# EAGLE schematic SOL_AMPV2 (EAGLE 7.4.0)

## Sheet 1 of 4
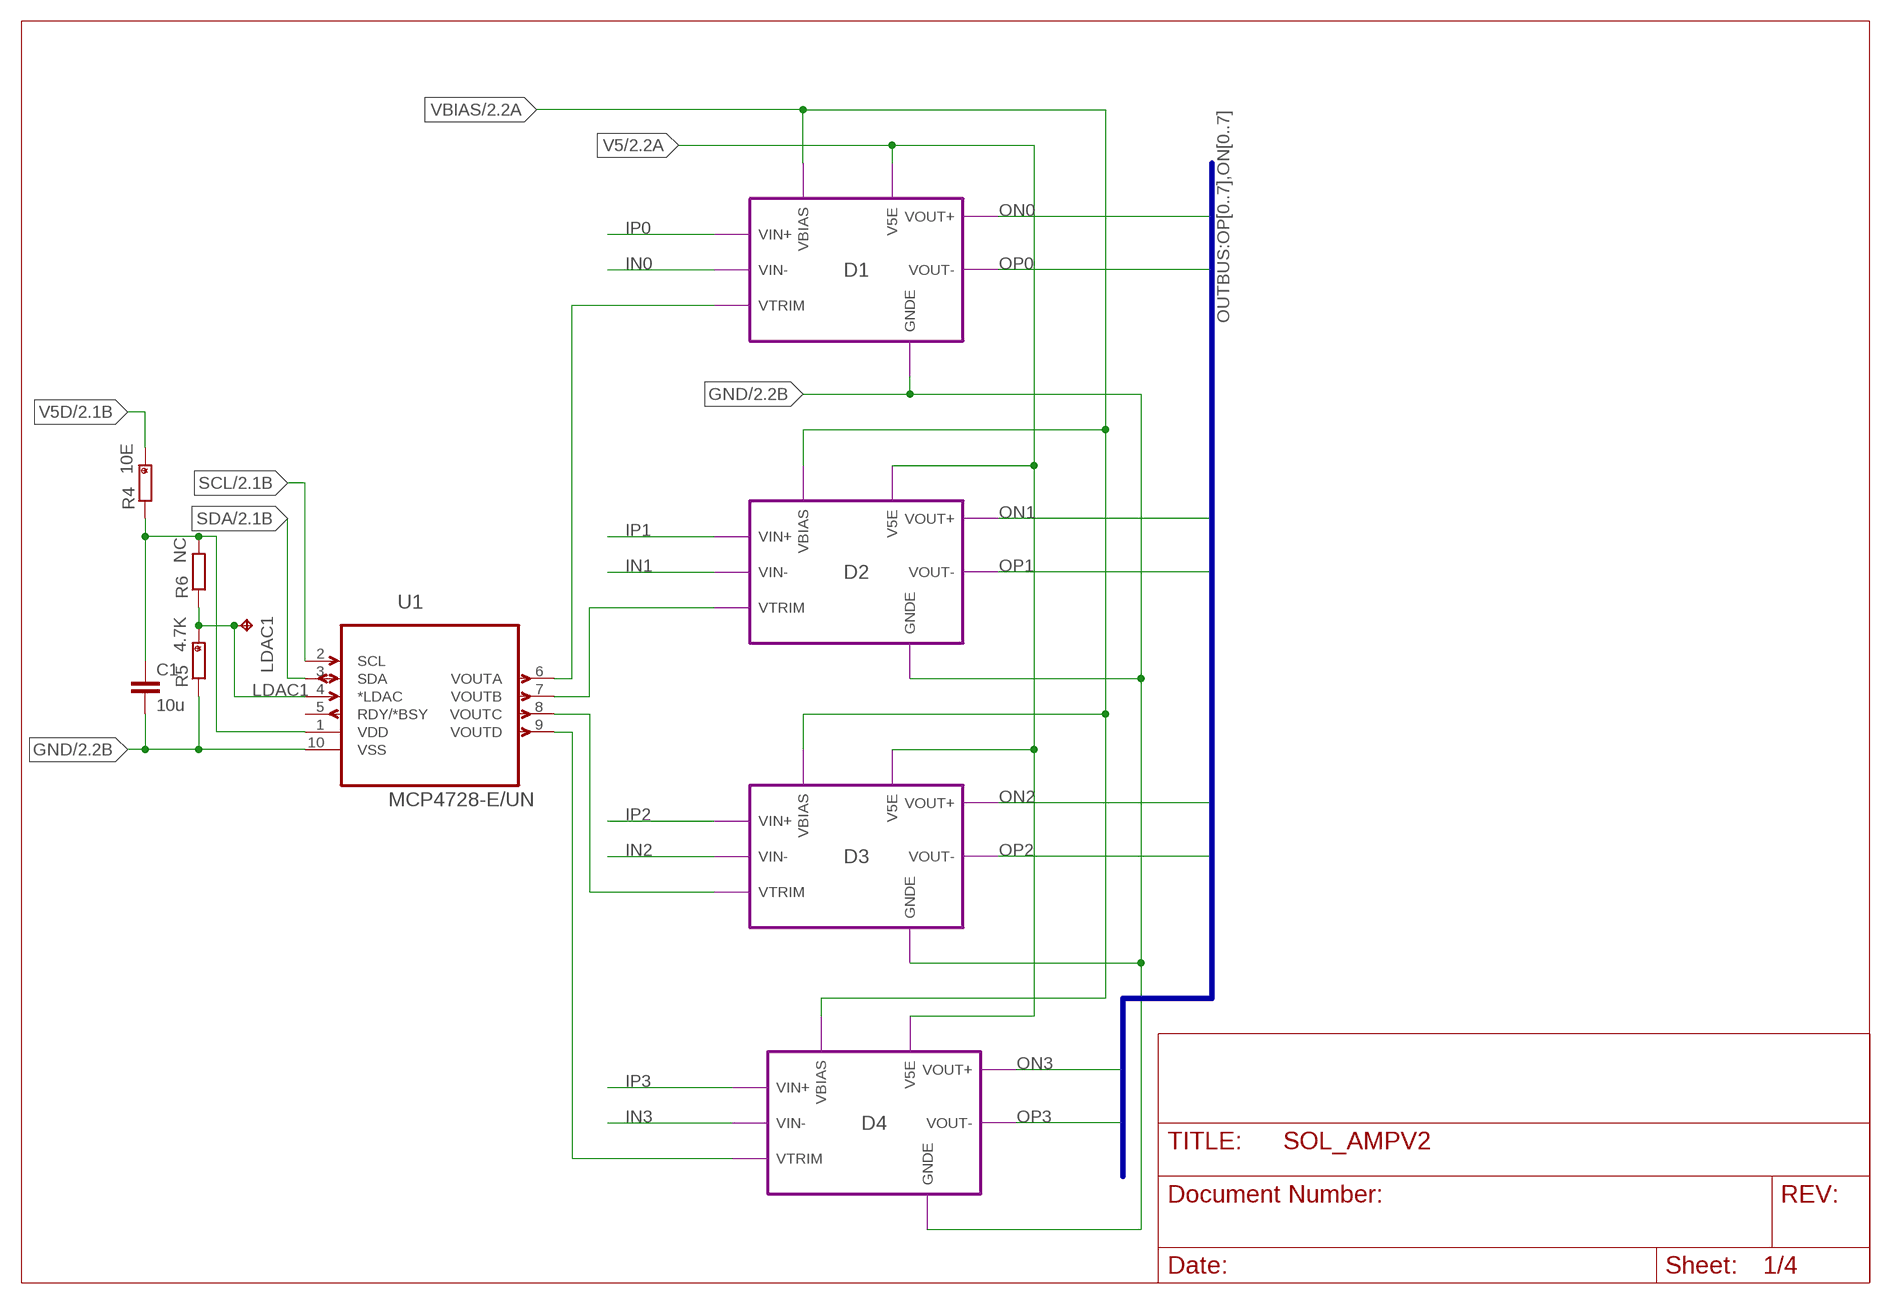
[diagram p0: schematic, sheet 1]

### Parts
C1  10u  C-EUC0805  [C0805]
LDAC1  UA_TPPAD1-13  [UA_P1-13]
R4  10E  R_HAND  [R0805H]
R5  4.7K  R_HAND  [R0805H]
R6  NC  R-EU_R0402  [R0402]
U1  MCP4728-E/UN  [SOP50P490X110-10N]

### Module instances
D2 = DIFFAMP
D1 = DIFFAMP
D3 = DIFFAMP
D4 = DIFFAMP

### Nets
GND: C1.2 R5.1 U1.10(VSS) ; port D2.GNDE D3.GNDE D4.GNDE D1.GNDE ; also sheet 2,3,4
IN0: port D1.VIN- ; also sheet 3
IN1: port D2.VIN- ; also sheet 3
IN2: port D3.VIN- ; also sheet 3
IN3: port D4.VIN- ; also sheet 3
IP0: port D1.VIN+ ; also sheet 3
IP1: port D2.VIN+ ; also sheet 3
IP2: port D3.VIN+ ; also sheet 3
IP3: port D4.VIN+ ; also sheet 3
LDAC1: LDAC1.TP R5.2 R6.1 U1.4(*LDAC)
N$1: C1.1 R4.1 R6.2 U1.1(VDD)
ON0: port D1.VOUT+ ; also sheet 3
ON1: port D2.VOUT+ ; also sheet 3
ON2: port D3.VOUT+ ; also sheet 3
ON3: port D4.VOUT+ ; also sheet 3
OP0: port D1.VOUT- ; also sheet 3
OP1: port D2.VOUT- ; also sheet 3
OP2: port D3.VOUT- ; also sheet 3
OP3: port D4.VOUT- ; also sheet 3
SCL: U1.2(SCL) ; also sheet 2,4
SDA: U1.3(SDA) ; also sheet 2,4
V5: port D2.V5E D3.V5E D4.V5E D1.V5E ; also sheet 2,4
V5D: R4.2 ; also sheet 2,4
VBIAS: port D2.VBIAS D3.VBIAS D4.VBIAS D1.VBIAS ; also sheet 2,4
VTR1: U1.6(VOUTA) ; port D1.VTRIM
VTR2: U1.7(VOUTB) ; port D2.VTRIM
VTR3: U1.8(VOUTC) ; port D3.VTRIM
VTR4: U1.9(VOUTD) ; port D4.VTRIM
Unconnected: U1.5(RDY/*BSY)

### Buses
OUTBUS:OP[0..7],ON[0..7]

## Sheet 2 of 4
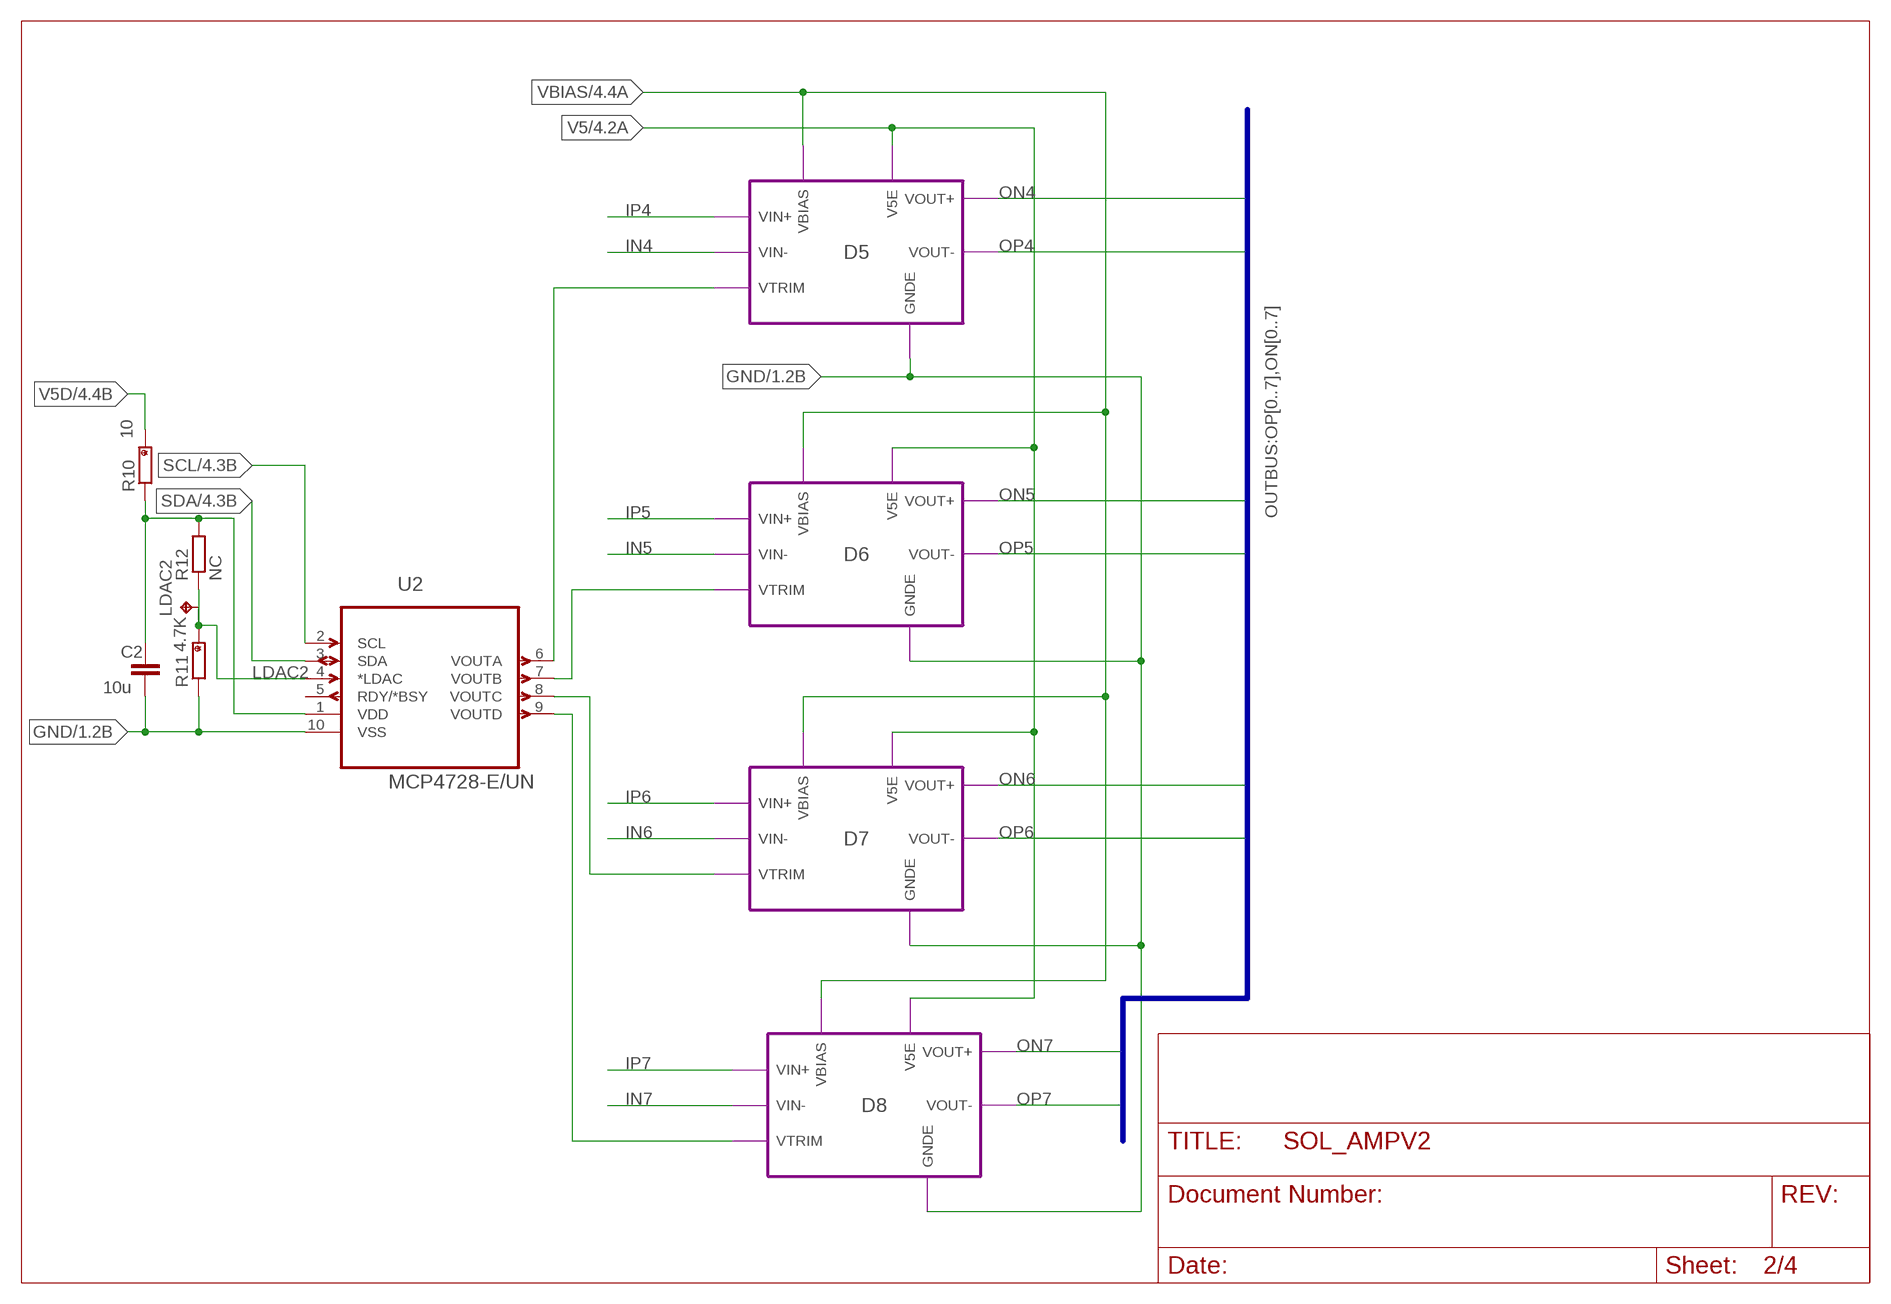
[diagram p1: schematic, sheet 2]

### Parts
C2  10u  C-EUC0805  [C0805]
LDAC2  UA_TPPAD1-13  [UA_P1-13]
R10  10  R_HAND  [R0805H]
R11  4.7K  R_HAND  [R0805H]
R12  NC  R-EU_R0402  [R0402]
U2  MCP4728-E/UN  [SOP50P490X110-10N]

### Module instances
D5 = DIFFAMP
D6 = DIFFAMP
D7 = DIFFAMP
D8 = DIFFAMP

### Nets
GND: C2.2 R11.1 U2.10(VSS) ; port D6.GNDE D7.GNDE D8.GNDE D5.GNDE ; also sheet 1,3,4
IN4: port D5.VIN- ; also sheet 3
IN5: port D6.VIN- ; also sheet 3
IN6: port D7.VIN- ; also sheet 3
IN7: port D8.VIN- ; also sheet 3
IP4: port D5.VIN+ ; also sheet 3
IP5: port D6.VIN+ ; also sheet 3
IP6: port D7.VIN+ ; also sheet 3
IP7: port D8.VIN+ ; also sheet 3
LDAC2: LDAC2.TP R11.2 R12.1 U2.4(*LDAC)
N$11: C2.1 R10.1 R12.2 U2.1(VDD)
ON4: port D5.VOUT+ ; also sheet 3
ON5: port D6.VOUT+ ; also sheet 3
ON6: port D7.VOUT+ ; also sheet 3
ON7: port D8.VOUT+ ; also sheet 3
OP4: port D5.VOUT- ; also sheet 3
OP5: port D6.VOUT- ; also sheet 3
OP6: port D7.VOUT- ; also sheet 3
OP7: port D8.VOUT- ; also sheet 3
SCL: U2.2(SCL) ; also sheet 1,4
SDA: U2.3(SDA) ; also sheet 1,4
V5: port D5.V5E D6.V5E D7.V5E D8.V5E ; also sheet 1,4
V5D: R10.2 ; also sheet 1,4
VBIAS: port D6.VBIAS D7.VBIAS D8.VBIAS D5.VBIAS ; also sheet 1,4
VTR5: U2.6(VOUTA) ; port D5.VTRIM
VTR6: U2.7(VOUTB) ; port D6.VTRIM
VTR7: U2.8(VOUTC) ; port D7.VTRIM
VTR8: U2.9(VOUTD) ; port D8.VTRIM
Unconnected: U2.5(RDY/*BSY)

### Buses
OUTBUS:OP[0..7],ON[0..7]

## Sheet 3 of 4
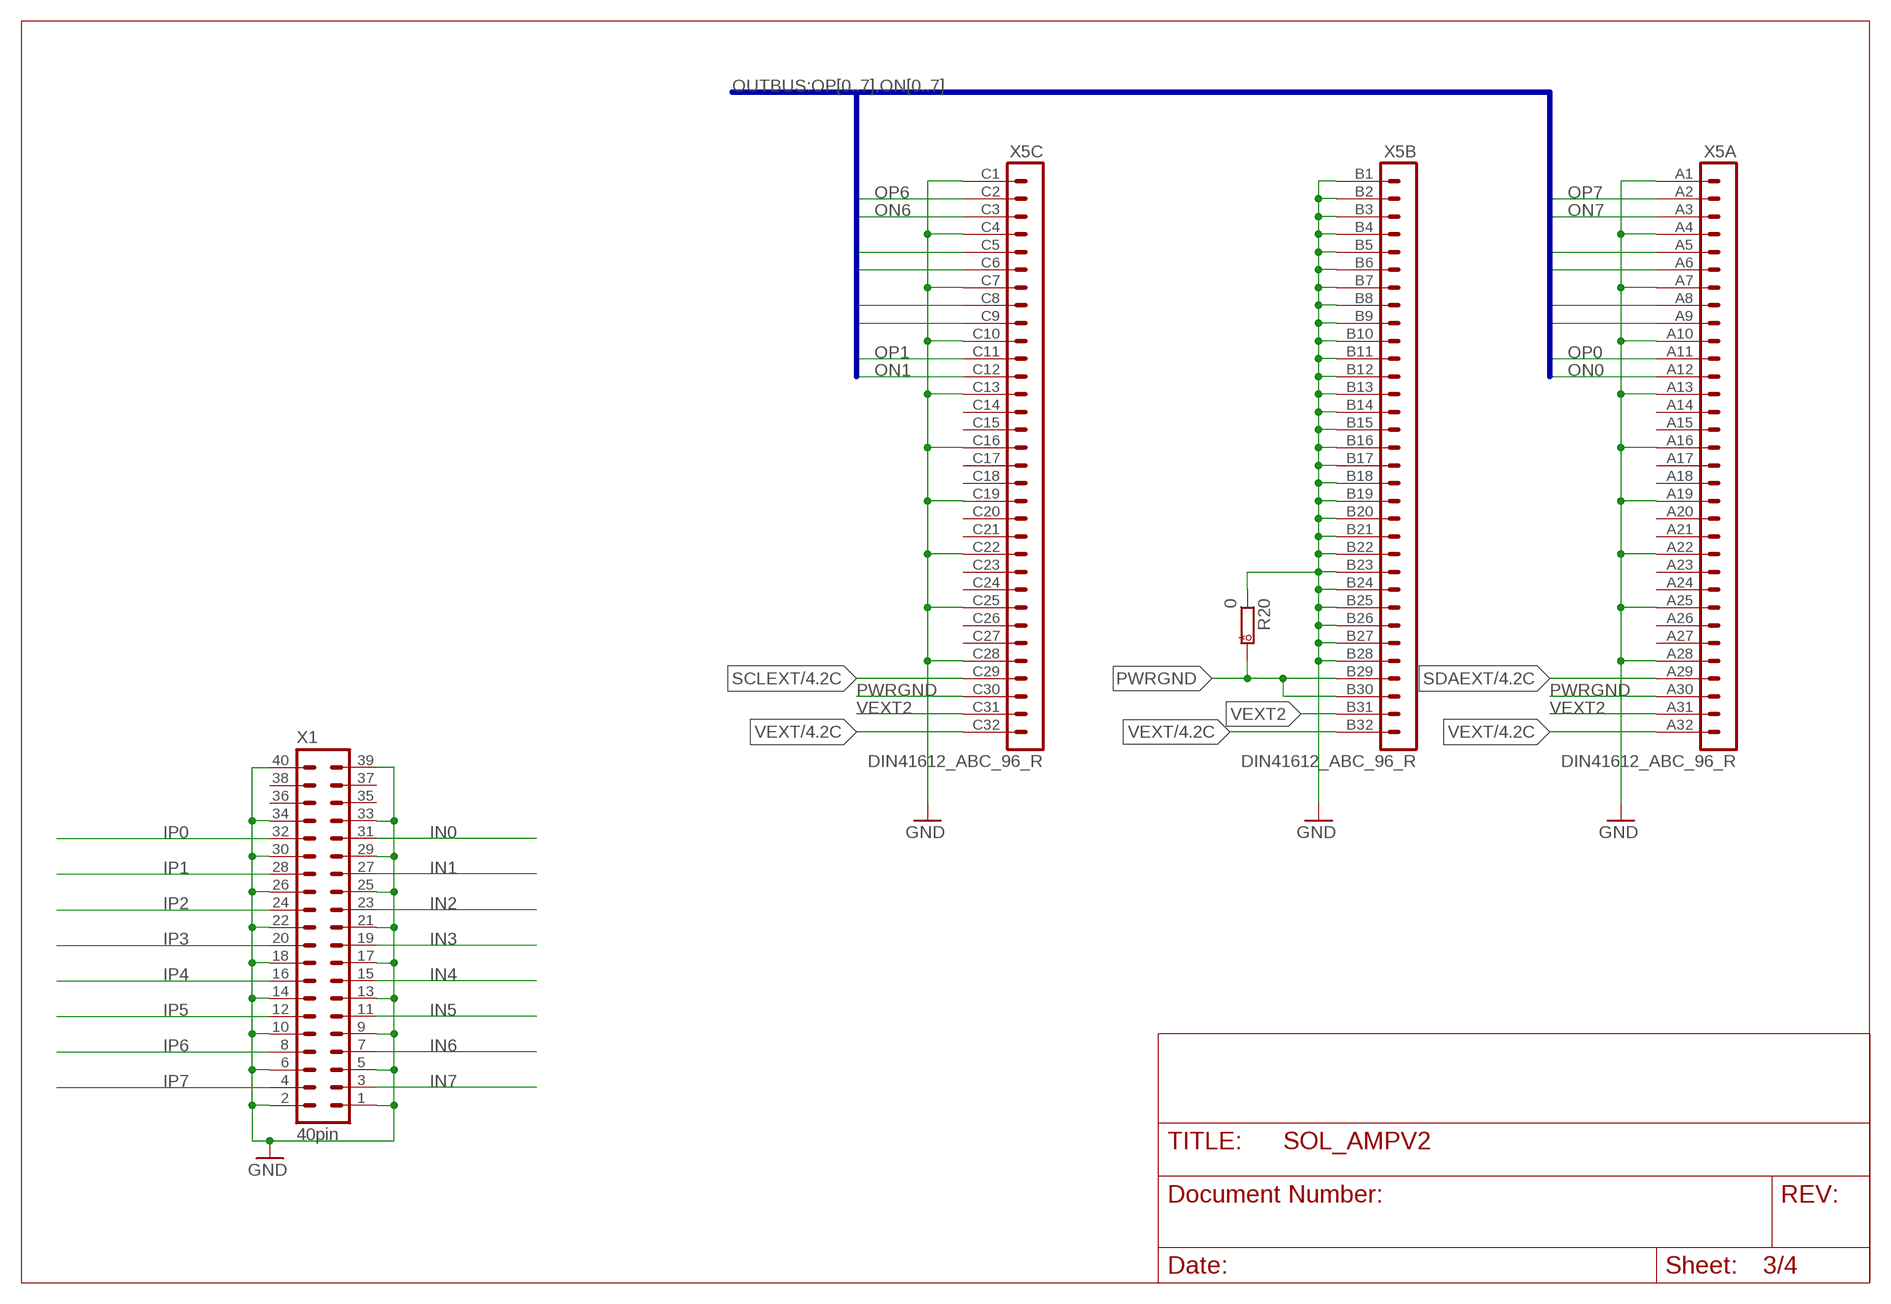
[diagram p2: schematic, sheet 3]

### Parts
R20  0  R_HAND  [R0805H]
X1  40pin  ML40L  [ML40L]
X5  DIN41612_ABC_96_R  [DIN41612_96RC]

### Nets
GND: R20.1 X1.1 X1.2 X1.5 X1.6 X1.9 X1.10 X1.13 X1.14 X1.17 X1.18 X1.21 X1.22 X1.25 X1.26 X1.29 X1.30 X1.33 X1.34 X1.39 X1.40 X5.A1 X5.A4 X5.A7 X5.A10 X5.A13 X5.A16 X5.A19 X5.A22 X5.A25 X5.A28 X5.B1 X5.B2 X5.B3 X5.B4 X5.B5 X5.B6 X5.B7 X5.B8 X5.B9 X5.B10 X5.B11 X5.B12 X5.B13 X5.B14 X5.B15 X5.B16 X5.B17 X5.B18 X5.B19 X5.B20 X5.B21 X5.B22 X5.B23 X5.B24 X5.B25 X5.B26 X5.B27 X5.B28 X5.C1 X5.C4 X5.C7 X5.C10 X5.C13 X5.C16 X5.C19 X5.C22 X5.C25 X5.C28 ; also sheet 1,2,4
IN0: X1.31 ; also sheet 1
IN1: X1.27 ; also sheet 1
IN2: X1.23 ; also sheet 1
IN3: X1.19 ; also sheet 1
IN4: X1.15 ; also sheet 2
IN5: X1.11 ; also sheet 2
IN6: X1.7 ; also sheet 2
IN7: X1.3 ; also sheet 2
IP0: X1.32 ; also sheet 1
IP1: X1.28 ; also sheet 1
IP2: X1.24 ; also sheet 1
IP3: X1.20 ; also sheet 1
IP4: X1.16 ; also sheet 2
IP5: X1.12 ; also sheet 2
IP6: X1.8 ; also sheet 2
IP7: X1.4 ; also sheet 2
ON0: X5.A12 ; also sheet 1
ON1: X5.C12 ; also sheet 1
ON2: X5.A9 ; also sheet 1
ON3: X5.C9 ; also sheet 1
ON4: X5.A6 ; also sheet 2
ON5: X5.C6 ; also sheet 2
ON6: X5.C3 ; also sheet 2
ON7: X5.A3 ; also sheet 2
OP0: X5.A11 ; also sheet 1
OP1: X5.C11 ; also sheet 1
OP2: X5.A8 ; also sheet 1
OP3: X5.C8 ; also sheet 1
OP4: X5.A5 ; also sheet 2
OP5: X5.C5 ; also sheet 2
OP6: X5.C2 ; also sheet 2
OP7: X5.A2 ; also sheet 2
PWRGND: R20.2 X5.A30 X5.B29 X5.B30 X5.C30
SCLEXT: X5.C29 ; also sheet 4
SDAEXT: X5.A29 ; also sheet 4
VEXT: X5.A32 X5.B32 X5.C32 ; also sheet 4
VEXT2: X5.A31 X5.B31 X5.C31
Unconnected: X1.35 X1.36 X1.37 X1.38 X5.A14 X5.A15 X5.A17 X5.A18 X5.A20 X5.A21 X5.A23 X5.A24 X5.A26 X5.A27 X5.C14 X5.C15 X5.C17 X5.C18 X5.C20 X5.C21 X5.C23 X5.C24 X5.C26 X5.C27

### Buses
OUTBUS:OP[0..7],ON[0..7]

## Sheet 4 of 4
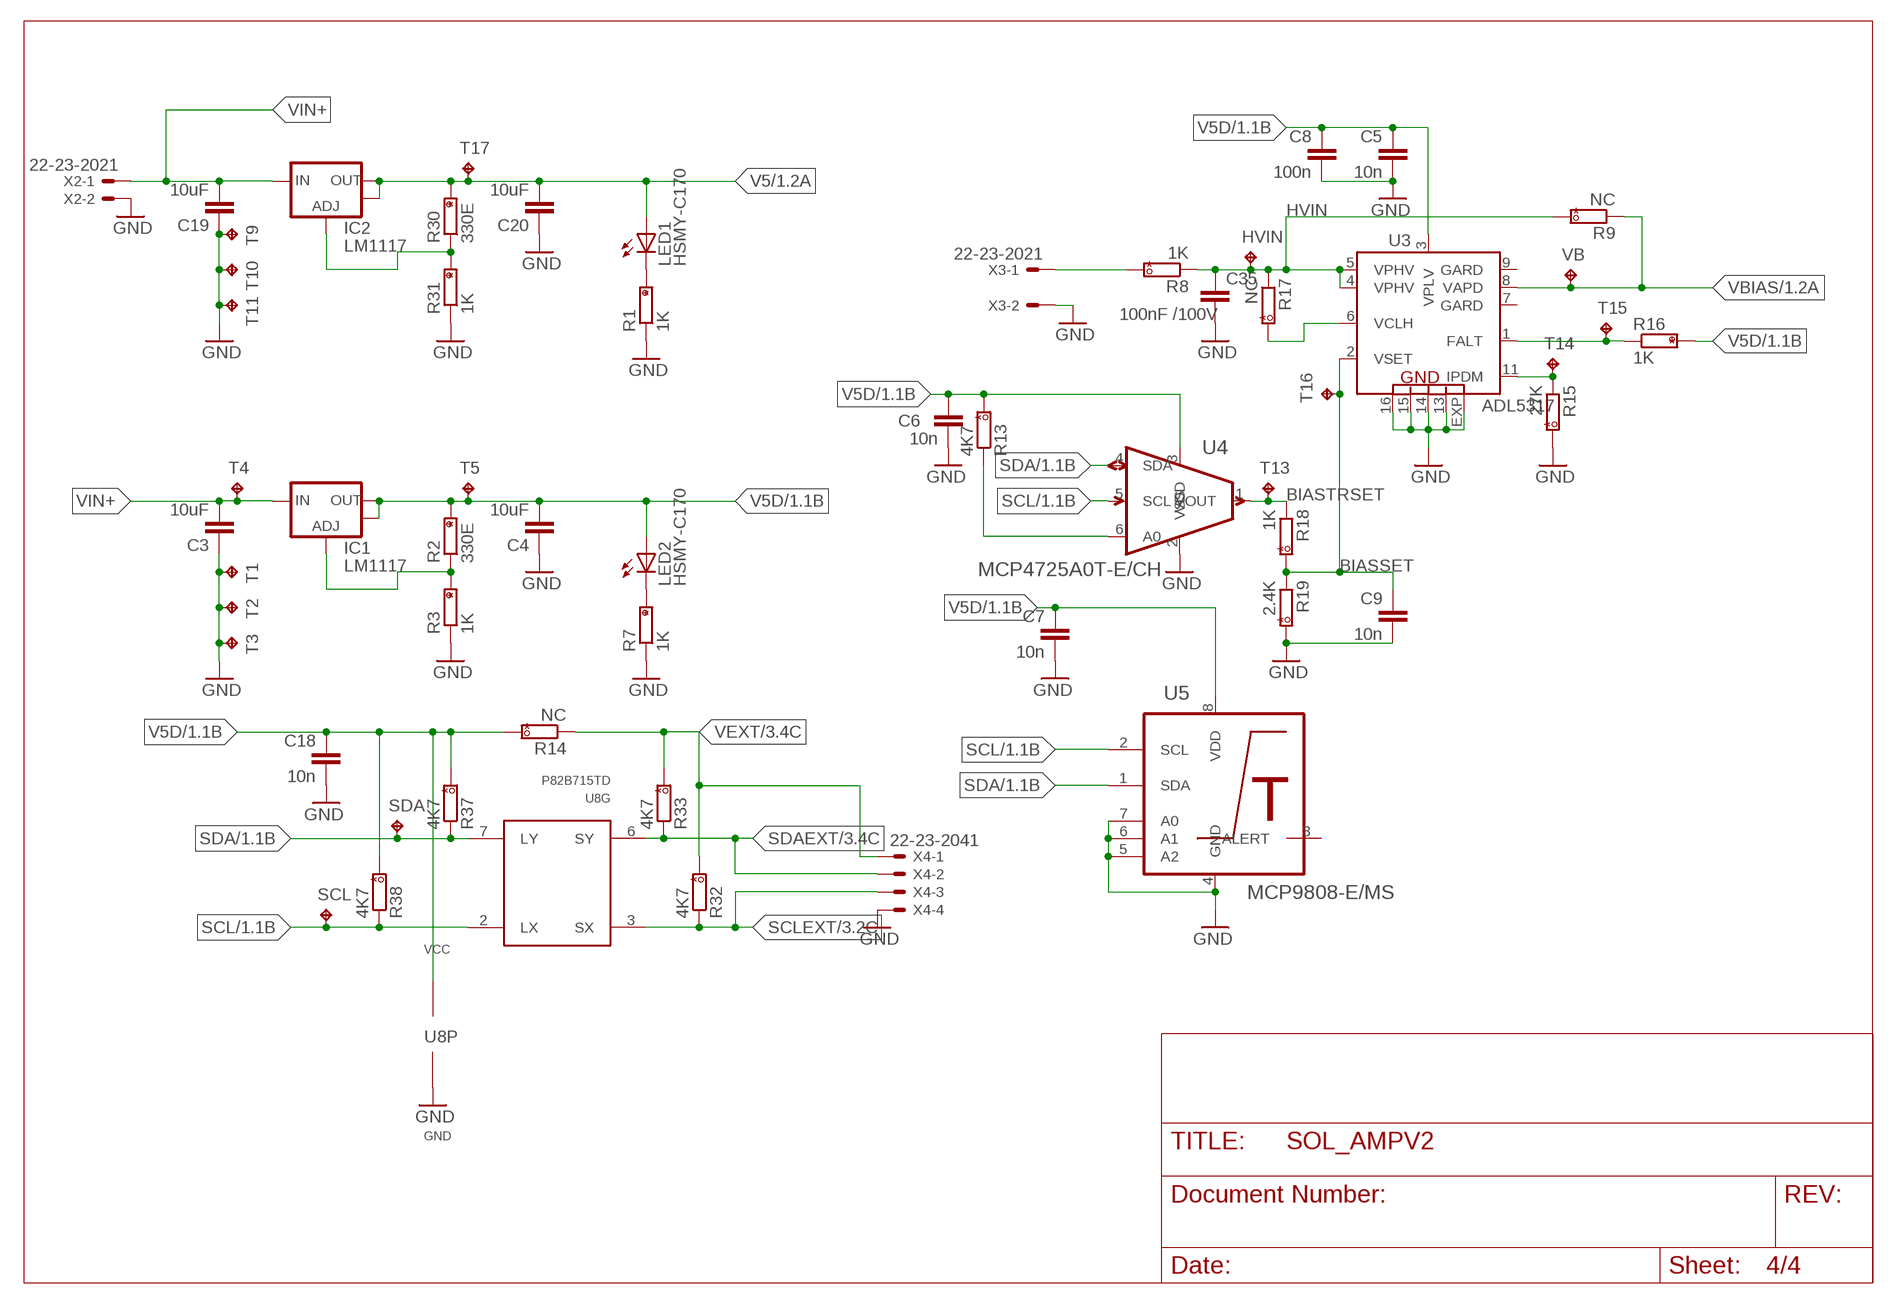
[diagram p3: schematic, sheet 4]

### Parts
C3  10uF  C-EUC0805  [C0805]
C4  10uF  C-EUC0805  [C0805]
C5  10n  C-EUC0805  [C0805]
C6  10n  C-EUC0805  [C0805]
C7  10n  C-EUC0805  [C0805]
C8  100n  C-EUC0805  [C0805]
C9  10n  C-EUC0805  [C0805]
C18  10n  C-EUC0805  [C0805]
C19  10uF  C-EUC0805  [C0805]
C20  10uF  C-EUC0805  [C0805]
C35  100nF /100V  C-EUC0805K  [C0805K]
HVIN  UA_TPPAD1-13  [UA_P1-13]
IC1  LM1117  V_REG_LM1117SOT223  [SOT223]
IC2  LM1117  V_REG_LM1117SOT223  [SOT223]
LED1  HSMY-C170  LEDCHIP-LED0805  [CHIP-LED0805]
LED2  HSMY-C170  LEDCHIP-LED0805  [CHIP-LED0805]
R1  1K  R_HAND  [R0805H]
R2  330E  R_HAND  [R0805H]
R3  1K  R_HAND  [R0805H]
R7  1K  R_HAND  [R0805H]
R8  1K  R_HAND  [R0805H]
R9  NC  R_HAND  [R0805H]
R13  4K7  R_HAND  [R0805H]
R14  NC  R_HAND  [R0805H]
R15  27K  R_HAND  [R0805H]
R16  1K  R_HAND  [R0805H]
R17  NC  R_HAND  [R0805H]
R18  1K  R_HAND  [R0805H]
R19  2.4K  R_HAND  [R0805H]
R30  330E  R_HAND  [R0805H]
R31  1K  R_HAND  [R0805H]
R32  4K7  R_HAND  [R0805H]
R33  4K7  R_HAND  [R0805H]
R37  4K7  R_HAND  [R0805H]
R38  4K7  R_HAND  [R0805H]
SCL  UA_TPPAD1-13  [UA_P1-13]
SDA  UA_TPPAD1-13  [UA_P1-13]
T1  UA_TPPAD1-13  [UA_P1-13]
T2  UA_TPPAD1-13  [UA_P1-13]
T3  UA_TPPAD1-13  [UA_P1-13]
T4  UA_TPPAD1-13  [UA_P1-13]
T5  UA_TPPAD1-13  [UA_P1-13]
T9  UA_TPPAD1-13  [UA_P1-13]
T10  UA_TPPAD1-13  [UA_P1-13]
T11  UA_TPPAD1-13  [UA_P1-13]
T13  UA_TPPAD1-13  [UA_P1-13]
T14  UA_TPPAD1-13  [UA_P1-13]
T15  UA_TPPAD1-13  [UA_P1-13]
T16  UA_TPPAD1-13  [UA_P1-13]
T17  UA_TPPAD1-13  [UA_P1-13]
U3  ADL5317  [LFCSP_LQ-16_MANSOL]
U4  MCP4725A0T-E/CH  [SOT95P270X145-6N]
U5  MCP9808-E/MS  [SOP65P490X110-8N]
U8  P82B715TD  82B715TD  [SO8]
VB  UA_TPPAD1-13  [UA_P1-13]
X2  22-23-2021  [22-23-2021]
X3  22-23-2021  [22-23-2021]
X4  22-23-2041  [22-23-2041]

### Nets
BIASSET: C9.1 R18.2 R19.1 T16.TP U3.2(VSET)
BIASTRSET: R18.1 T13.TP U4.1(VOUT)
GND: C3.1 C4.1 C5.2 C6.2 C7.2 C8.2 C9.2 C18.2 C19.1 C20.1 C35.2 R1.1 R3.1 R7.1 R15.2 R19.2 R31.1 T1.TP T2.TP T3.TP T9.TP T10.TP T11.TP U3.13(GND) U3.14(GND) U3.15(GND) U3.16(GND) U3.EXP(GND) U4.2(VSS) U5.4(GND) U5.5(A2) U5.6(A1) U5.7(A0) U8.4(P:GND) X2.2 X3.2 X4.4 ; also sheet 1,2,3
HVIN: C35.1 HVIN.TP R8.1 R9.2 R17.1 U3.4(VPHV) U3.5(VPHV)
N$2: IC1.1(ADJ) R2.1 R3.2
N$3: LED1.C R1.2
N$4: LED2.C R7.2
N$5: R8.2 X3.1
N$7: R15.1 T14.TP U3.11(IPDM)
N$9: R17.2 U3.6(VCLH)
N$10: R13.1 U4.6(A0)
N$13: R16.1 T15.TP U3.1(FALT)
N$20: IC2.1(ADJ) R30.1 R31.2
SCL: R38.1 SCL.TP U4.5(SCL) U5.2(SCL) U8.2(G:LX) ; also sheet 1,2
SCLEXT: R32.1 U8.3(G:SX) X4.3 ; also sheet 3
SDA: R37.1 SDA.TP U4.4(SDA) U5.1(SDA) U8.7(G:LY) ; also sheet 1,2
SDAEXT: R33.1 U8.6(G:SY) X4.2 ; also sheet 3
V5: C20.2 IC2.2(OUT) IC2.4(OUT) LED1.A R30.2 T17.TP ; also sheet 1,2
V5D: C4.2 C5.1 C6.1 C7.1 C8.1 C18.1 IC1.2(OUT) IC1.4(OUT) LED2.A R2.2 R13.2 R14.2 R16.2 R37.2 R38.2 T5.TP U3.3(VPLV) U4.3(VDD) U5.8(VDD) U8.8(P:VCC) ; also sheet 1,2
VBIAS: R9.1 U3.8(VAPD) VB.TP ; also sheet 1,2
VEXT: R14.1 R32.2 R33.2 X4.1 ; also sheet 3
VIN+: C3.2 C19.2 IC1.3(IN) IC2.3(IN) T4.TP X2.1
Unconnected: U3.7(GARD) U3.9(GARD) U5.3(ALERT) U8.1(NC:NC) U8.5(NC:NC)

## Library data of the parts
C1 C2 C35 = rcl:C-EU: CAPACITOR, European symbol
C3-C9 C18-C20 = rcl:C-EU: CAPACITOR, European symbol; PARTNO: *
HVIN LDAC1 LDAC2 SCL SDA T1-T5 T9-T11 T13-T17 VB = UA_v2:UA_TP: Test pad; PARTNO: *
IC1 IC2 = SparkFunEagle-6-6-07:V_REG_LM1117: Voltage Regulator LM1117 Standard adjustable voltage regulator but in SMD form. Spark Fun Electronics SKU : COM-00595
LED1 LED2 = led:LED: LED OSRAM: - CHIPLED LG R971, LG N971, LY N971, LG Q971, LY Q971, LO R971, LY R971 LH N974, LH R974 LS Q976, LO Q976, LY Q976 LO Q996 - Hyper CHIPLED LW Q18S LB Q993, LB Q99A, LB R99A - SideLED LS A670, LO A670, LY A670, LG A670, LP A670 LB A673, LV A673, LT A673, LW A673 LH A674 LY A675 LS A676, LA A676, LO A676, LY A676, LW A676 LS A679, LY A679, LG A679 - Hyper Micro SIDELED® LS Y876, LA Y876, LO Y876, LY Y876 LT Y87S - SmartLED LW L88C, LW L88S LB L89C, LB L89S, LG L890 LS L89K, LO L89K, LY L89K LS L896, LA L896, LO L896, LY L896 - TOPLED LS T670, LO T670, LY T670, LG T670, LP T670 LSG T670, LSP T670, LSY T670, LOP T670, LYG T670 LG T671, LOG T671, LSG T671 LB T673, LV T673, LT T673, LW T673 LH T674 LS T676, LA T676, LO T676, LY T676, LB T676, LH T676, LSB T676, LW T676 LB T67C, LV T67C, LT T67C, LS T67K, LO T67K, LY T67K, LW E67C LS E67B, LA E67B, LO E67B, LY E67B, LB E67C, LV E67C, LT E67C LW T67C LS T679, LY T679, LG T679 LS T770, LO T770, LY T770, LG T770, LP T770 LB T773, LV T773, LT T773, LW T773 LH T774 LS E675, LA E675, LY E675, LS T675 LS T776, LA T776, LO T776, LY T776, LB T776 LHGB T686 LT T68C, LB T68C - Hyper Mini TOPLED® LB M676 - Mini TOPLED Santana® LG M470 LS M47K, LO M47K, LY M47K Source: http://www.osram.convergy.de LUXEON: - LUMILED® LXK2-PW12-R00, LXK2-PW12-S00, LXK2-PW14-U00, LXK2-PW14-V00 LXK2-PM12-R00, LXK2-PM12-S00, LXK2-PM14-U00 LXK2-PE12-Q00, LXK2-PE12-R00, LXK2-PE12-S00, LXK2-PE14-T00, LXK2-PE14-U00 LXK2-PB12-K00, LXK2-PB12-L00, LXK2-PB12-M00, LXK2-PB14-N00, LXK2-PB14-P00, LXK2-PB14-Q00 LXK2-PR12-L00, LXK2-PR12-M00, LXK2-PR14-Q00, LXK2-PR14-R00 LXK2-PD12-Q00, LXK2-PD12-R00, LXK2-PD12-S00 LXK2-PH12-R00, LXK2-PH12-S00 LXK2-PL12-P00, LXK2-PL12-Q00, LXK2-PL12-R00 Source: www.luxeon.com KINGBRIGHT: KA-3528ASYC Source: www.kingbright.com
R1-R3 R7-R9 R13-R20 R30-R33 R37 R38 = UA_v2:R_HAND; PARTNO: *
R4 R5 R10 R11 = UA_v2:R_HAND
R6 R12 = resistor:R-EU_: RESISTOR, European symbol
U1 U2 = MCP4728:MCP4728-E/UN: IC, DAC, 12BIT, QUAD; MPN: MCP4728-E/UN; OC_FARNELL: 1800217; OC_NEWARK: 08R1808; PACKAGE: MSOP-10; SUPPLIER: MICROCHIP
U3 = adl783:ADL5317: APD voltage regulator; OC_FARNELL: 2462433
U4 = MCP4725A0T:MCP4725A0T-E/CH: 12-Bit Digital-to-Analog Converter with EEPROM; MPN: MCP4725A0T-E/CH; OC_FARNELL: 1578449; OC_NEWARK: 77M3032; PACKAGE: SOT-23-6; SUPPLIER: Microchip
U5 = MCP4725A0T:MCP9808-E/MS: Digital Temperature Sensor,MSOP-8; MPN: MCP9808-E/MS; OC_FARNELL: 2080523; OC_NEWARK: 89T8871; PACKAGE: MSOP-8; SUPPLIER: MICROCHIP
U8 = UA_v2:82B715: I2C bus extender; PARTNO: P82B715TD,112
X1 = con-harting-ml:ML40: HARTING; OC_FARNELL: unknown; OC_NEWARK: unknown
X2 X3 = con-molex:22-23-2021: .100" (2.54mm) Center Header - 2 Pin; MF: MOLEX; MPN: 22-23-2021; OC_FARNELL: 1462926; OC_NEWARK: 25C3832
X4 = con-molex:22-23-2041: .100" (2.54mm) Center Header - 4 Pin; MF: MOLEX; MPN: 22-23-2041; OC_FARNELL: 1462920; OC_NEWARK: 38C0355
X5 = con3:DIN41612_ABC_96_R

## Module DIFFAMP
Ports: VIN+(in) VIN-(in) VTRIM(in) V5E(pwr) GNDE(pwr) VBIAS(in) VOUT+(out) VOUT-(out)
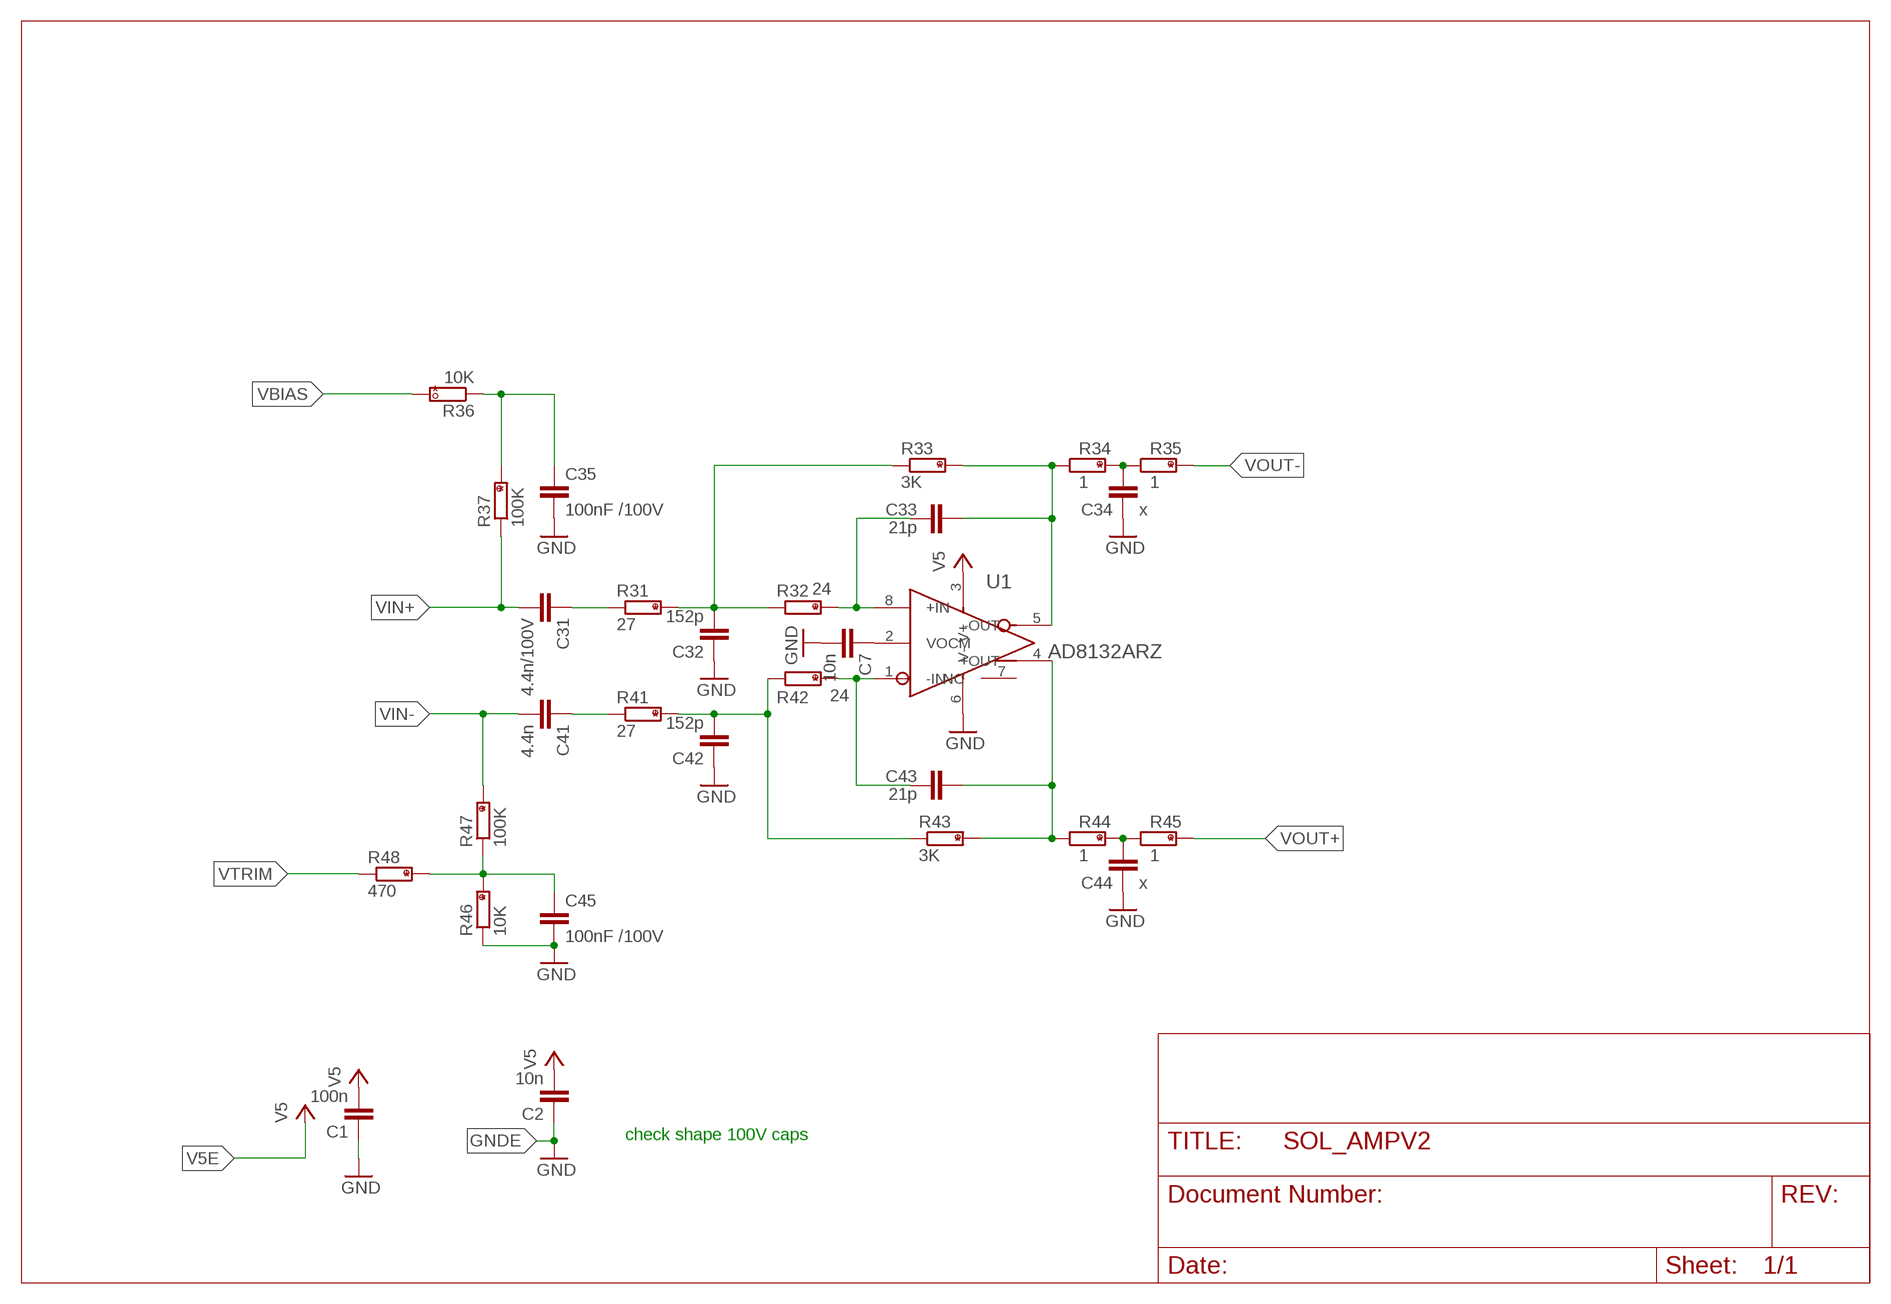
[diagram p4: schematic, module DIFFAMP, sheet 1]

### Parts
C1  100n  C-EUC0805K  [C0805K]
C2  10n  C-EUC0805K  [C0805K]
C7  10n  C-EUC0805K  [C0805K]
C31  4.4n/100V  C-EUC0805K  [C0805K]
C32  152p  C-EUC0805K  [C0805K]
C33  21p  C-EUC0805K  [C0805K]
C34  x  C-EUC0805K  [C0805K]
C35  100nF /100V  C-EUC0805K  [C0805K]
C41  4.4n  C-EUC0805K  [C0805K]
C42  152p  C-EUC0805K  [C0805K]
C43  21p  C-EUC0805K  [C0805K]
C44  x  C-EUC0805K  [C0805K]
C45  100nF /100V  C-EUC0805K  [C0805K]
R31  27  R_HAND  [R0805H]
R32  24  R_HAND  [R0805H]
R33  3K  R_HAND  [R0805H]
R34  1  R_HAND  [R0805H]
R35  1  R_HAND  [R0805H]
R36  10K  R_HAND  [R0805H]
R37  100K  R_HAND  [R0805H]
R41  27  R_HAND  [R0805H]
R42  24  R_HAND  [R0805H]
R43  3K  R_HAND  [R0805H]
R44  1  R_HAND  [R0805H]
R45  1  R_HAND  [R0805H]
R46  10K  R_HAND  [R0805H]
R47  100K  R_HAND  [R0805H]
R48  470  R_HAND  [R0805H]
U1  AD8132ARZ  [SOIC127P600X175-8N]

### Nets
AOUT+: C43.2 R43.2 R44.1 U1.4(+OUT)
AOUT-: C33.2 R33.2 R34.1 U1.5(-OUT)
FB+: C32.2 R31.2 R32.1 R33.1
FB-: C42.2 R41.2 R42.1 R43.1
GNDE: C1.1 C2.1 C7.2 C32.1 C34.1 C35.2 C42.1 C44.1 C45.2 R46.1 U1.6(V-) ; supply symbol labelled GND
N$1: C34.2 R34.2 R35.1
N$2: C7.1 U1.2(VOCM)
N$3: C44.2 R44.2 R45.1
N$4: C43.1 R42.2 U1.1(-IN)
N$5: C33.1 R32.2 U1.8(+IN)
N$10: C41.1 R41.1
R31: C31.1 R31.1
V5E: C1.2 C2.2 U1.3(V+) ; supply symbol labelled V5
VB+: C35.1 R36.1 R37.2
VB-: C45.1 R46.2 R47.1 R48.2
VBIAS: R36.2
VIN+: C31.2 R37.1
VIN-: C41.2 R47.2
VOUT+: R45.2
VOUT-: R35.2
VTRIM: R48.1
Unconnected: U1.7(NC)

### Notes on the sheet
- check shape 100V caps

### Library data of the parts
C1 C2 C7 C31-C35 C41-C45 = rcl:C-EU: CAPACITOR, European symbol
R31-R37 R41-R48 = UA_v2:R_HAND
U1 = ua_cmp:AD8132ARZ: Low Cost, High Speed Differential Amplifier; MPN: AD8132ARZ; OC_FARNELL: 9426043; OC_NEWARK: 19M8885; PACKAGE: SOIC-8; SUPPLIER: Analog Devices